# Altium schematic sheet DM35_Power_C_V1.0.SchDoc
size A4
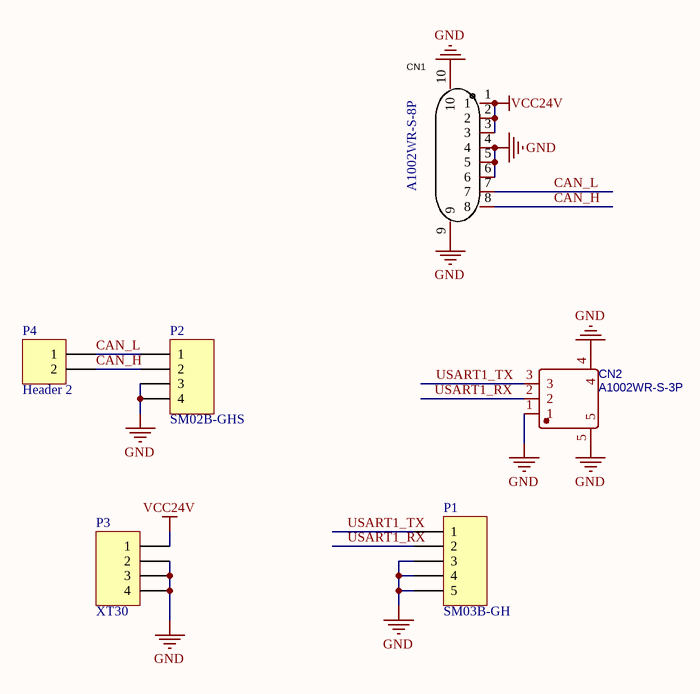
[diagram p0: DM35_Power_C_V1.0.SchDoc]

## Parts
CN1  A1002WR-S-8P  [CONN-SMD_A1002WR-S-8P]
CN2  A1002WR-S-3P  [CONN-SMD_A1002WR-S-3P]
P1  SM03B-GH  [JST SM03B-GHS-TB]
P2  SM02B-GHS  [JST-SM02B-GHS-TB]
P3  XT30  [XT30PW-M]
P4  Header 2  [HDR1X2]

## Nets
GND: CN1.4 CN1.5 CN1.6 CN1.9 CN1.10 CN2.1 CN2.4 CN2.5 P1.3 P1.4 P1.5 P2.3 P2.4 P3.2 P3.3 P3.4
VCC24V: CN1.1 CN1.2 CN1.3 P3.1
CAN_H: CN1.8 P2.2 P4.2
CAN_L: CN1.7 P2.1 P4.1
USART1_RX: CN2.2 P1.2
USART1_TX: CN2.3 P1.1

## Library data of the parts
CN1 = A1002WR-S-8P: Manufacturer: CJT(长江连接器); Add into BOM: yes; Connector Type: 接头; Pitch: 0.039"(1.00mm); Number of Positions: 8; Name: A1002WR-S-8P; Symbol: A1002WR-S-8P; Device: A1002WR-S-8P; LCSC Part Name: 8P,脚距1mm; Supplier Part: C239526; Manufacturer Part: A1002WR-S-8P; Supplier Footprint: SMD,P=1mm; JLCPCB Part Class: Extended Part; Datasheet: https://atta.szlcsc.com/upload/public/pdf/watermark/20190926/C239526_E6EB898D74B3D7AFB647860A542281E4.pdf; Supplier: LCSC; Convert to PCB: yes; Series: SH; Contact Type: 公形引脚; Number of Rows: 1; Row Spacing: -; Mounting Type: 表面贴装; Contact Material: 磷青铜
CN2 = A1002WR-S-3P: BOM_Manufacturer: Changjiang Connectors; Contributor: LCSC; BOM_Supplier: LCSC; BOM_Supplier Part: C239521; BOM_Manufacturer Part: A1002WR-S-3P; spicePre: C; spiceSymbolName: A1002WR-S-3P
P1 = Header 5: Header, 5-Pin; LatestRevisionDate: 17-Jul-2002; LatestRevisionNote: Re-released for DXP Platform.; Publisher: Altium Limited
P2 P3 = Header 4: Header, 4-Pin; LatestRevisionDate: 17-Jul-2002; LatestRevisionNote: Re-released for DXP Platform.; Publisher: Altium Limited
P4 = Header 2: Header, 2-Pin; LatestRevisionDate: 17-Jul-2002; LatestRevisionNote: Re-released for DXP Platform.; Publisher: Altium Limited